# Altium schematic sheet POC - Bluetooth.SchDoc
size A4
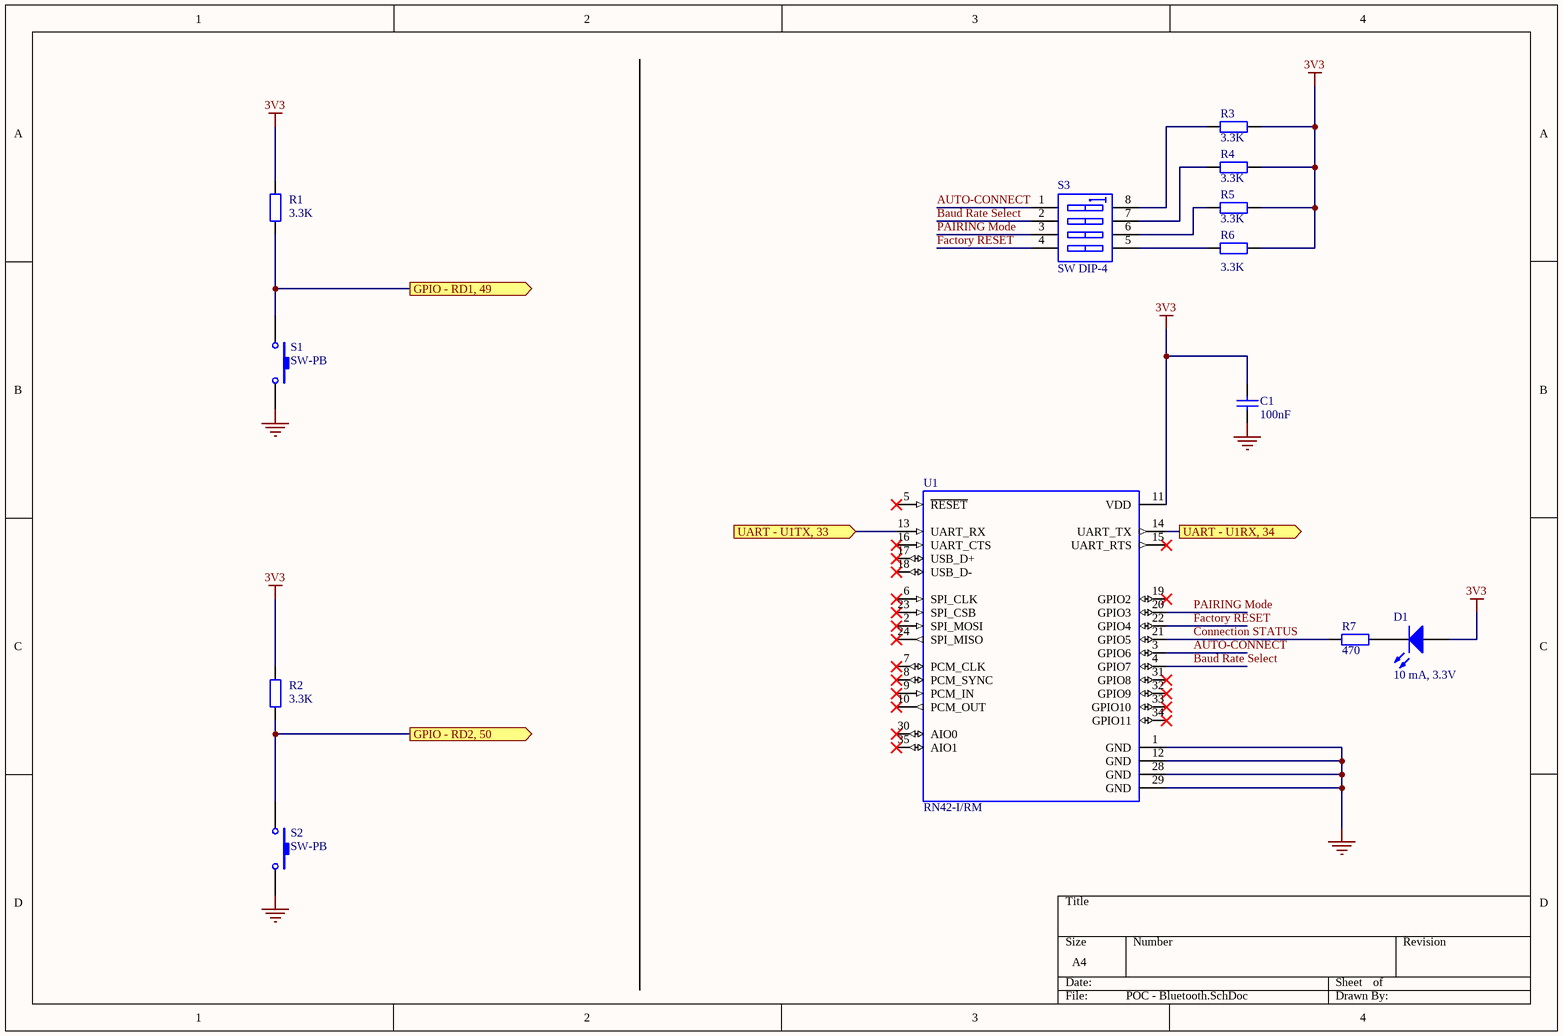
[diagram p0: POC - Bluetooth.SchDoc]

## Parts
C1  100nF  [RAD-0.3]
D1  10 mA, 3.3V  [LED-0]
R1  3.3K  [AXIAL-0.4]
R2  3.3K  [AXIAL-0.4]
R3  3.3K  [AXIAL-0.4]
R4  3.3K  [AXIAL-0.4]
R5  3.3K  [AXIAL-0.4]
R6  3.3K  [AXIAL-0.4]
R7  470  [AXIAL-0.4]
S1  SW-PB  [SPST-2]
S2  SW-PB  [SPST-2]
S3  SW DIP-4  [SO8_N]
U1  RN42-I/RM  [XCVR_RN42-I/RM]

## Ports
GPIO - RD1, 49 (out), GPIO - RD2, 50 (out), UART - U1RX, 34 (out), UART - U1TX, 33 (in)

## Nets
3V3: C1.1 D1.1(A) R1.1 R2.1 R3.2 R4.2 R5.2 R6.2 U1.11(VDD)
GND: C1.2 S1.2 S2.2 U1.1(GND) U1.12(GND) U1.28(GND) U1.29(GND)
AUTO-CONNECT: S3.1(A1) U1.3(GPIO6)
Baud Rate Select: S3.2(A2) U1.4(GPIO7)
Connection STATUS: R7.1 U1.21(GPIO5)
Factory RESET: S3.4(A4) U1.22(GPIO4)
GPIO - RD1, 49: R1.2 S1.1 ; port GPIO - RD1, 49
GPIO - RD2, 50: R2.2 S2.1 ; port GPIO - RD2, 50
PAIRING Mode: S3.3(A3) U1.20(GPIO3)
UART - U1RX, 34: U1.14(UART_TX) ; port UART - U1RX, 34
UART - U1TX, 33: U1.13(UART_RX) ; port UART - U1TX, 33
NetD1_2: D1.2(K) R7.2
NetR3_1: R3.1 S3.8(B1)
NetR4_1: R4.1 S3.7(B2)
NetR5_1: R5.1 S3.6(B3)
NetR6_1: R6.1 S3.5(B4)

Not connected (* = marked no-connect by the designer): U1 2(SPI_MOSI)* 5(~{RESET})* 6(SPI_CLK)* 7(PCM_CLK)* 8(PCM_SYNC)* 9(PCM_IN)* 10(PCM_OUT)* 15(UART_RTS)* 16(UART_CTS)* 17(USB_D+)* 18(USB_D-)* 19(GPIO2)* 23(SPI_CSB)* 24(SPI_MISO)* 30(AIO0)* 31(GPIO8)* 32(GPIO9)* 33(GPIO10)* 34(GPIO11)* 35(AIO1)*

## Library data of the parts
C1 = Cap: Capacitor; Fabricant: KEMET; RefFabricant: C320C104K1R5TA; RefFournisseur: 1457645; Fournisseur: Farnell; Published: 8-Jun-2000; LatestRevisionDate: 17-Jul-2002; LatestRevisionNote: Re-released for DXP Platform.; PackageReference: RAD-0.3; Publisher: Altium Limited; PackageDescription: Radial Cap, Thru-Hole; 2 Leads; 0.3 in Pin Spacing; Value: 100nF
D1 = LED0: Typical INFRARED GaAs LED; RefFabricant: FNL-U500B23CDSL; Fabricant: FORGE; Fournisseur: Farnell; RefFournisseur: 1200588; Published: 8-Jun-2000; LatestRevisionDate: 08-Jul-2005; LatestRevisionNote: Mech Layer 1 removed.; PackageReference: LED-0; Publisher: Altium Limited; PackageDescription: LED; 2 Leads
R1 = Res2: Resistor; Fabricant: MULTICOMP; RefFabricant: MF12 3K3; RefFournisseur: 9343040; Fournisseur: Farnell; Published: 8-Jun-2000; LatestRevisionDate: 17-Jul-2002; LatestRevisionNote: Re-released for DXP Platform.; PackageReference: AXIAL-0.4; Publisher: Altium Limited; PackageDescription: Axial Device, Thru-Hole; 2 Leads; 0.4 in Pin Spacing; Value: 3.3K
R2-R6 = Res2: Resistor; Fabricant: MULTICOMP; Fournisseur: Farnell; RefFabricant: MF12 3K3; RefFournisseur: 9343040; Published: 8-Jun-2000; LatestRevisionDate: 17-Jul-2002; LatestRevisionNote: Re-released for DXP Platform.; PackageReference: AXIAL-0.4; Publisher: Altium Limited; PackageDescription: Axial Device, Thru-Hole; 2 Leads; 0.4 in Pin Spacing; Value: 3.3K
R7 = Res2: Resistor; Published: 8-Jun-2000; LatestRevisionDate: 17-Jul-2002; LatestRevisionNote: Re-released for DXP Platform.; PackageReference: AXIAL-0.4; Publisher: Altium Limited; PackageDescription: Axial Device, Thru-Hole; 2 Leads; 0.4 in Pin Spacing; Value: 470
S1 = SW-PB: Switch; Fabricant: RAFI; RefFabricant: 1.14.100.501/0000; Fournisseur: Farnell; RefFournisseur: 1142066; Published: 24-Mar-1999; LatestRevisionDate: 17-Jul-2002; LatestRevisionNote: Re-released for DXP Platform.; PackageReference: SPST-2; Publisher: Altium Limited; PackageDescription: Switch; 2 Leads
S2 = SW-PB: Switch; Fabricant: RAFI; Fournisseur: Farnell; RefFabricant: 1.14.100.501/0000; RefFournisseur: 1142066; Published: 24-Mar-1999; LatestRevisionDate: 17-Jul-2002; LatestRevisionNote: Re-released for DXP Platform.; PackageReference: SPST-2; Publisher: Altium Limited; PackageDescription: Switch; 2 Leads
S3 = SW DIP-4: DIP Switch, 4 Position, SPST; Fabricant: ALCOSWITCH - TE CONNECTIVITY; Fournisseur: Farnell; RefFabricant: ADF0404; RefFournisseur: 1363071; Published: 24-Mar-1999; LatestRevisionDate: 29-May-2009; LatestRevisionNote: IPC-7351 Footprint Added.; PackageVersion: Dec-2002; PackageReference: SO8; Publisher: Altium Limited; PackageDescription: 8-Pin Small Outline Integrated Circuit 1.27 mm Pitch; Code_JEDEC: MS-012-AA; Code_IPC: SOIC127P600-8
U1 = RN42-I/RM: Bluetooth Module; MF: Microchip; Fournisseur: Farnell; RefFournisseur: 2775075; RefFabricant: RN42HID-I/RM; MP: RN42-I/RM; Price: None; Package: SMD-35 Roving Networks; Availability: Warning; Value: *; Fabricant: Microchip